# Altium schematic sheet 2_INTERFACES_EXTERNAS.SchDoc
size Tabloid; SheetNumber: 2; SheetTotal: 3; SPICEModelCacheOXJGALYG: <root> / <DocumentId>OXJGALYG</DocumentId> / <CacheFrame Number="0"> / <Model Name="0603_885012206052_1uf" Kind="CKT"> / <Text>******* / .subckt 0603_885012206052_1uF 1 2 / Rser 1 3 0.00742821402486 / Lser 2 4 2.51142993E-10 / C1 3 4 0.000001 / Rpar 3 4 100000000 / .ends 0603_885012206052_1uF</Text> / </Model> / </CacheFrame> / </root>
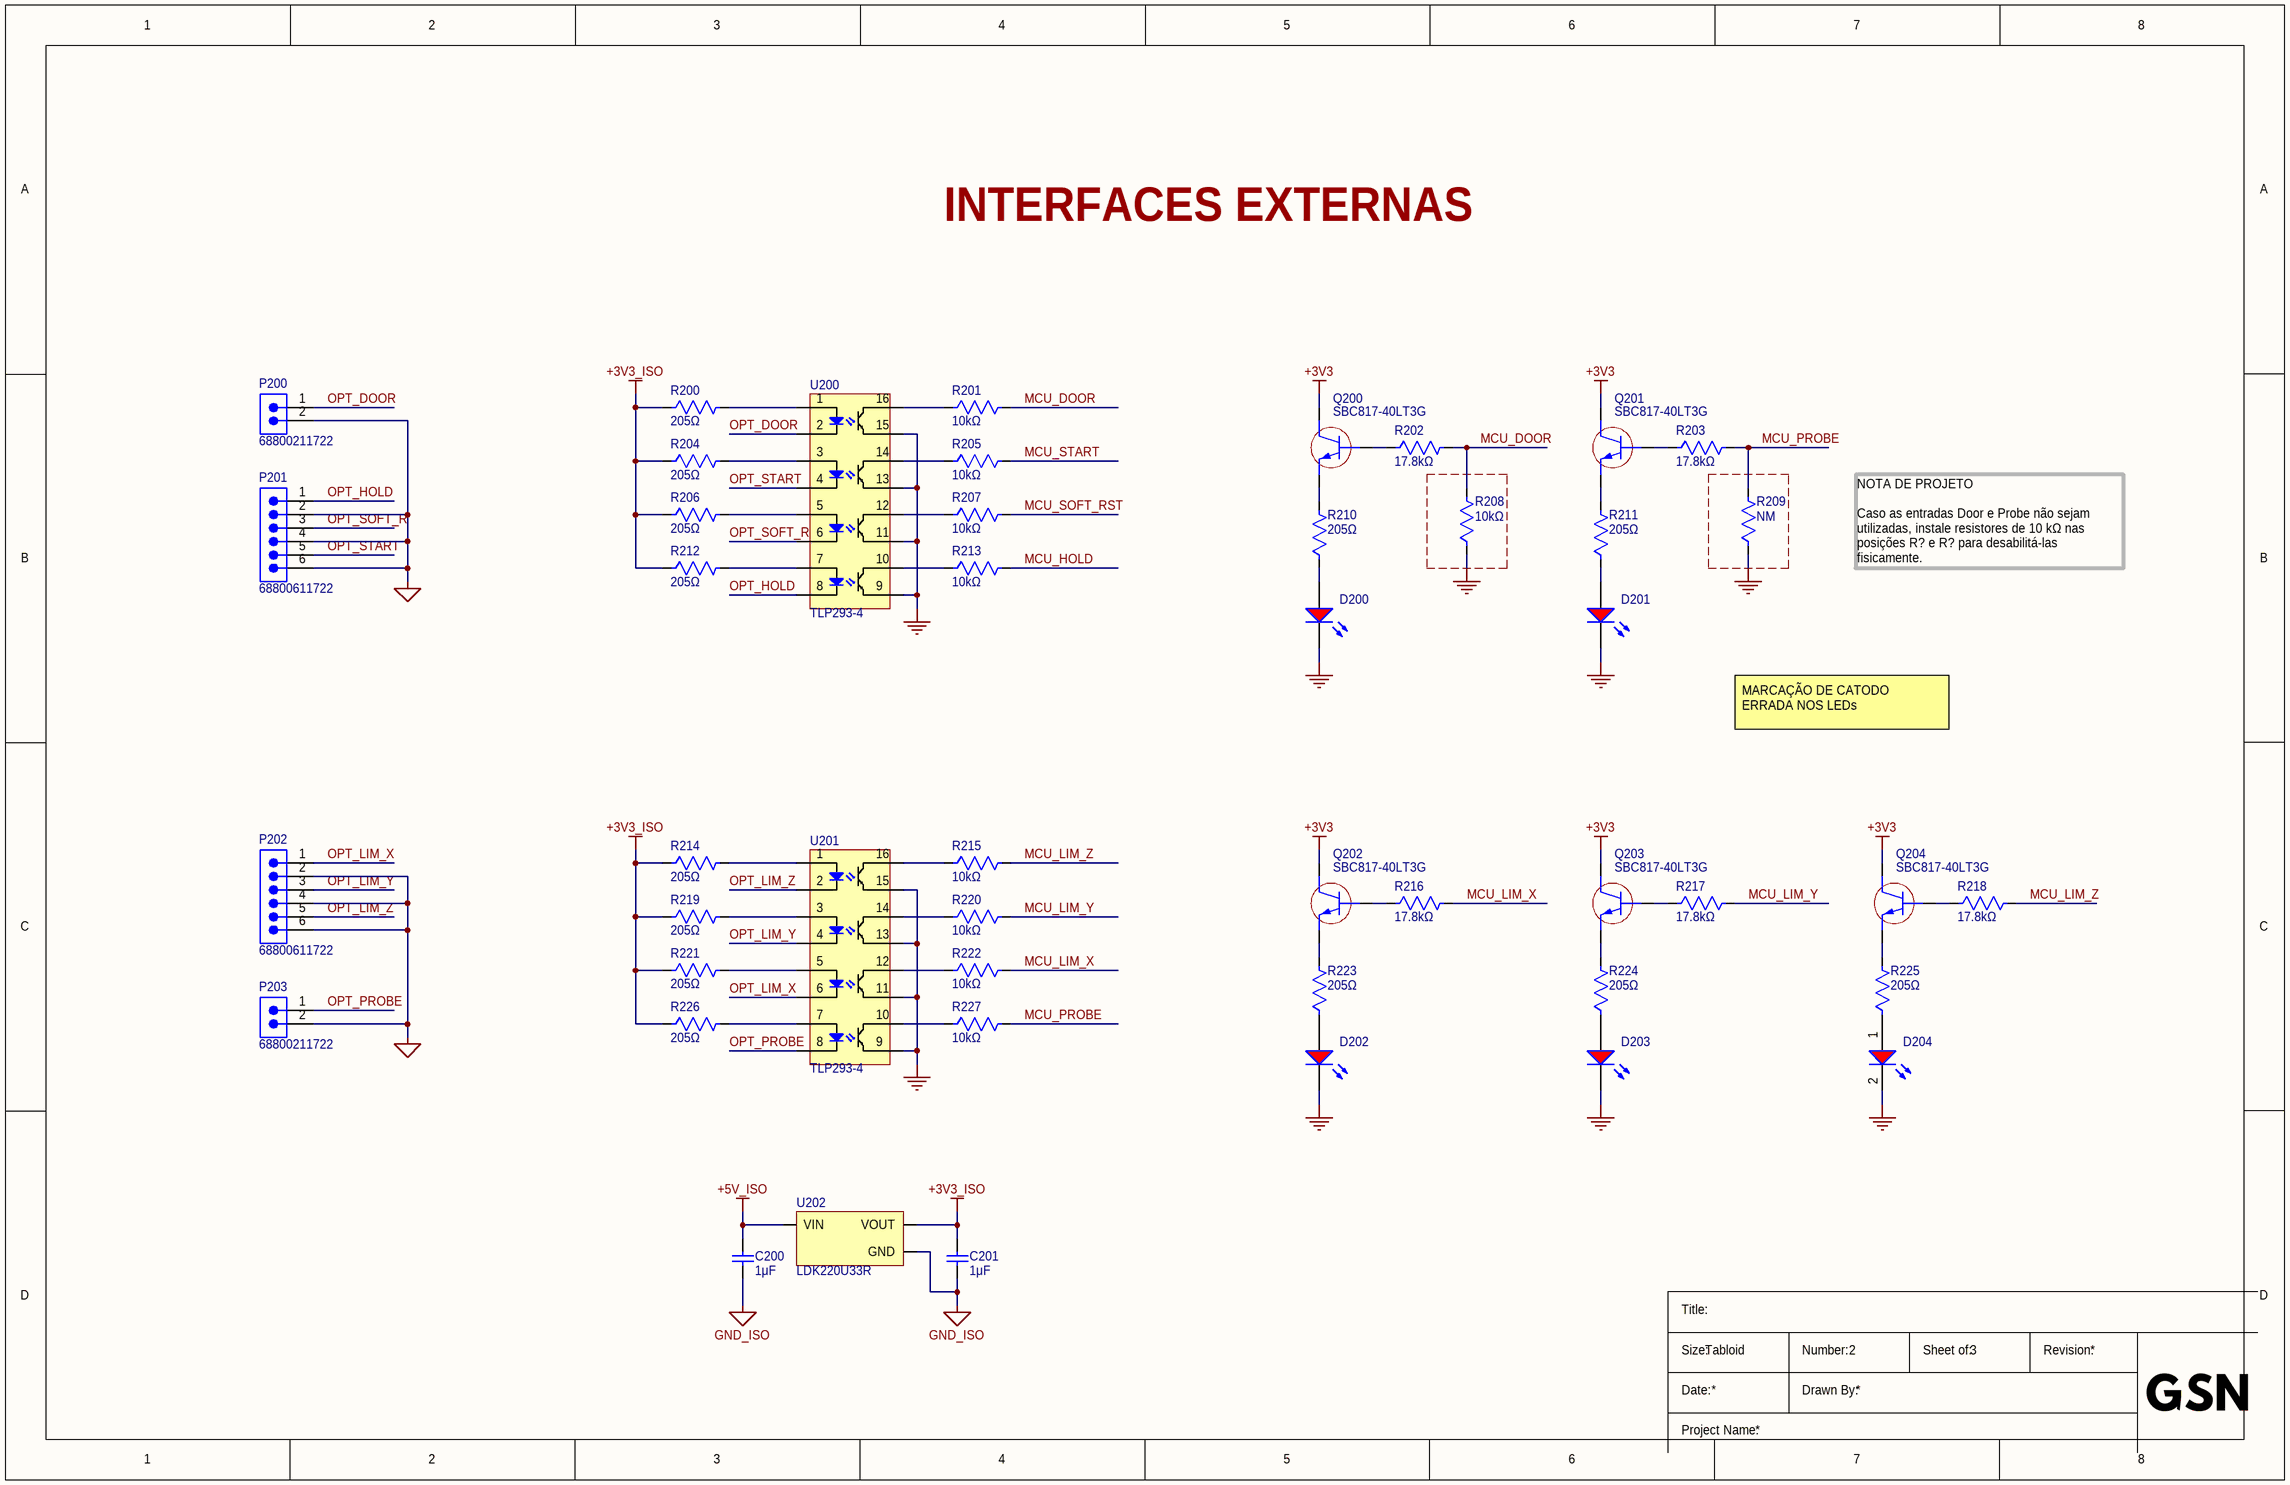
[diagram p0: 2_INTERFACES_EXTERNAS.SchDoc]

## Parts
C200  1μF  [WCAP-CSGP_0603_L1.6W0.8H0.8_Wave]
C201  1μF  [WCAP-CSGP_0603_L1.6W0.8H0.8_Wave]
D200  Red, 2V, 140deg  [WL-SMCW_0603_150060xx75003]  (value not drawn)
D201  Red, 2V, 140deg  [WL-SMCW_0603_150060xx75003]  (value not drawn)
D202  Red, 2V, 140deg  [WL-SMCW_0603_150060xx75003]  (value not drawn)
D203  Red, 2V, 140deg  [WL-SMCW_0603_150060xx75003]  (value not drawn)
D204  Red, 2V, 140deg  [WL-SMCW_0603_150060xx75003]  (value not drawn)
P200  68800211722  [68800211722]
P201  68800611722  [68800611722]
P202  68800611722  [68800611722]
P203  68800211722  [68800211722]
Q200  SBC817-40LT3G  [SOT-23-3]
Q201  SBC817-40LT3G  [SOT-23-3]
Q202  SBC817-40LT3G  [SOT-23-3]
Q203  SBC817-40LT3G  [SOT-23-3]
Q204  SBC817-40LT3G  [SOT-23-3]
R200  205Ω  [0603-WAVE]
R201  10kΩ  [0603-WAVE]
R202  17.8kΩ  [0603-WAVE]
R203  17.8kΩ  [0603-WAVE]
R204  205Ω  [0603-WAVE]
R205  10kΩ  [0603-WAVE]
R206  205Ω  [0603-WAVE]
R207  10kΩ  [0603-WAVE]
R208  10kΩ  [0603-WAVE]
R209  NM  [0603-WAVE]
R210  205Ω  [0603-WAVE]
R211  205Ω  [0603-WAVE]
R212  205Ω  [0603-WAVE]
R213  10kΩ  [0603-WAVE]
R214  205Ω  [0603-WAVE]
R215  10kΩ  [0603-WAVE]
R216  17.8kΩ  [0603-WAVE]
R217  17.8kΩ  [0603-WAVE]
R218  17.8kΩ  [0603-WAVE]
R219  205Ω  [0603-WAVE]
R220  10kΩ  [0603-WAVE]
R221  205Ω  [0603-WAVE]
R222  10kΩ  [0603-WAVE]
R223  205Ω  [0603-WAVE]
R224  205Ω  [0603-WAVE]
R225  205Ω  [0603-WAVE]
R226  205Ω  [0603-WAVE]
R227  10kΩ  [0603-WAVE]
U200  TLP293-4  [SO-16]
U201  TLP293-4  [SO-16]
U202  LDK220U33R  [SOT-89]

## Nets
+3V3: Q200.3(C) Q201.3(C) Q202.3(C) Q203.3(C) Q204.3(C)
+3V3_ISO: C201.2 R200.1 R204.1 R206.1 R212.1 R214.1 R219.1 R221.1 R226.1 U202.1(VOUT)
+5V_ISO: C200.2 U202.3(VIN)
GND: D200.2(K) D201.2(K) D202.2(K) D203.2(K) D204.2(K) R208.1 R209.1 U200.9 U200.11 U200.13 U200.15 U201.9 U201.11 U201.13 U201.15
GND_ISO: C200.1 C201.1 P200.2 P201.2 P201.4 P201.6 P202.2 P202.4 P202.6 P203.2 U202.2(GND)
MCU_DOOR: R201.2 R202.2 R208.2
MCU_HOLD: R213.2
MCU_LIM_X: R216.2 R222.2
MCU_LIM_Y: R217.2 R220.2
MCU_LIM_Z: R215.2 R218.2
MCU_PROBE: R203.2 R209.2 R227.2
MCU_SOFT_RST: R207.2
MCU_START: R205.2
OPT_DOOR: P200.1 U200.2
OPT_HOLD: P201.1 U200.8
OPT_LIM_X: P202.1 U201.6
OPT_LIM_Y: P202.3 U201.4
OPT_LIM_Z: P202.5 U201.2
OPT_PROBE: P203.1 U201.8
OPT_SOFT_R: P201.3 U200.6
OPT_START: P201.5 U200.4
NetD200_1: D200.1(A) R210.1
NetD201_1: D201.1(A) R211.1
NetD202_1: D202.1(A) R223.1
NetD203_1: D203.1(A) R224.1
NetD204_1: D204.1(A) R225.1
NetQ200_1: Q200.1(B) R202.1
NetQ200_2: Q200.2(E) R210.2
NetQ201_1: Q201.1(B) R203.1
NetQ201_2: Q201.2(E) R211.2
NetQ202_1: Q202.1(B) R216.1
NetQ202_2: Q202.2(E) R223.2
NetQ203_1: Q203.1(B) R217.1
NetQ203_2: Q203.2(E) R224.2
NetQ204_1: Q204.1(B) R218.1
NetQ204_2: Q204.2(E) R225.2
NetR200_2: R200.2 U200.1
NetR201_1: R201.1 U200.16
NetR204_2: R204.2 U200.3
NetR205_1: R205.1 U200.14
NetR206_2: R206.2 U200.5
NetR207_1: R207.1 U200.12
NetR212_2: R212.2 U200.7
NetR213_1: R213.1 U200.10
NetR214_2: R214.2 U201.1
NetR215_1: R215.1 U201.16
NetR219_2: R219.2 U201.3
NetR220_1: R220.1 U201.14
NetR221_2: R221.2 U201.5
NetR222_1: R222.1 U201.12
NetR226_2: R226.2 U201.7
NetR227_1: R227.1 U201.10

## Notes on the sheet
- INTERFACES EXTERNAS
- NOTA DE PROJETO
  Caso as entradas Door e Probe não sejam utilizadas, instale resistores de 10 kΩ nas posições R? e R? para desabilitá-las fisicamente.
- MARCAÇÃO DE CATODO ERRADA NOS LEDs
- Title:
- Size:
- Tabloid
- Number:
- Sheet of:
- Revision:
- Date:
- Project Name:
- Drawn By:

## Library data of the parts
C200 C201 = 885012206052: WCAP-CSGP Multilayer Ceramic Chip Capacitor, General Purpose, size 0603, 1μF, 16V; Manufacturer: Wurth Elektronik; Case/Size Code: 0603; Capacitance: 1uF; Capacitance Tolerance: +/-10%; Ceramic Type: X7R; Dissipation Factor: 10%; Insulation Resistance: 0.1Gohm; Technical Reference: X7R0603105K016DFCT10000; Manufacturer Part Number: 885012206052; Category: Multilayer Ceramic Chip Capacitors; Match Code: WCAP-CSGP; ComponentLink1Description: Website Link; ComponentLink1URL: https://www.we-online.com/redexpert/article/885012206052?ad; ComponentLink2Description: Datasheet Link; ComponentLink2URL: https://www.we-online.com/redexpert/spec/885012206052?ad; Mount: Surface Mount; Operating Temperature Min: -55degC; Operating Temperature Max: 125degC; Packaging: Tape and Reel; Length: 1.6mm; Width: 0.8mm; Height: 0.8mm; Rated Voltage (DC): 16V
D200-D204 = 150060RS75003: WL-SMCW Mono-color Chip LED Waterclear, SMT, size 0603, Red, 2V, 140°; Manufacturer: Wurth Elektronik; Case/Size Code: 0603; Chip Technology: AlInGaP; Dominant Wavelength: 625nm; Luminous Intensity: 530mcd; Peak Wavelength: 630nm; Manufacturer Part Number: 150060RS75003; Category: Signal LEDs; Match Code: WL-SMCW; ComponentLink1Description: Website Link; ComponentLink1URL: https://www.we-online.com/redexpert/article/150060RS75003?ad; ComponentLink2Description: Datasheet Link; ComponentLink2URL: https://www.we-online.com/redexpert/spec/150060RS75003?ad; Mount: Surface Mount; Packaging: Tape and Reel; Length: 1.6mm; Width: 0.8mm; Height: 0.7mm; Emitting Color: Red; Forward Voltage: 2V; Viewing Angle: 140deg; Operating Temperature Min: -40degC; Operating Temperature Max: 100degC
P200 P203 = 68800211722: WR-WTB “J” Type THT Male Horizontal Shrouded Header, pitch 2.5 mm, 2 pins; Manufacturer: Wurth Elektronik; Contact Resistance: 20 mohm; Rated Current: 3 A; Working Voltage: 250 V(AC); Withstanding Voltage: 800 V(AC); Manufacturer Part Number: 68800211722; Category: Wire-to-Board Connector; Match Code: WR-WTB; ComponentLink1Description: Website Link; ComponentLink1URL: https://www.we-online.com/redexpert/article/68800211722?ad; ComponentLink2Description: Datasheet Link; ComponentLink2URL: https://www.we-online.com/redexpert/spec/68800211722?ad; Mount: Through Hole; Operating Temperature Min: -25degC; Operating Temperature Max: 85degC; Packaging: Bag; Length: 7.5 mm; Width: 8.3 mm; Height: 4.2 mm; Gender: Male; Number of Pins: 2; Number of Rows: 1; Orientation: Horizontal; Lead Pitch: 2.5 mm
P201 P202 = 68800611722: WR-WTB “J” Type THT Male Horizontal Shrouded Header, pitch 2.5 mm, 6 pins; Manufacturer: Wurth Elektronik; Contact Resistance: 20 mohm; Rated Current: 3 A; Working Voltage: 250 V(AC); Withstanding Voltage: 800 V(AC); Manufacturer Part Number: 68800611722; Category: Wire-to-Board Connector; Match Code: WR-WTB; ComponentLink1Description: Website Link; ComponentLink1URL: https://www.we-online.com/redexpert/article/68800611722?ad; ComponentLink2Description: Datasheet Link; ComponentLink2URL: https://www.we-online.com/redexpert/spec/68800611722?ad; Mount: Through Hole; Operating Temperature Min: -25degC; Operating Temperature Max: 85degC; Packaging: Bag; Length: 17.5 mm; Width: 8.3 mm; Height: 4.2 mm; Gender: Male; Number of Pins: 6; Number of Rows: 1; Orientation: Horizontal; Lead Pitch: 2.5 mm
Q200-Q204 = SBC817-40LT3G: TRANS NPN 45V 0.5A SOT23-3; Manufacturer: onsemi; Manufacturer Lifecycle Status: ACTIVE; Collector Base Voltage (VCBO): 50V; Continuous Collector Current: 500mA; Element Configuration: Single; Emitter Base Voltage (VEBO): 5V; Frequency: 100MHz; hFE Min: 250; Max Power Dissipation: 300mW; Number of Elements: 1; Supplier: DigiKey; Supplier Part Number: SBC817-40LT3GOSCT-ND; Manufacturer Part Number: SBC817-40LT3G; RoHS: Compliant; Category: BJTs; Stock: 144045; Pricing: 1=0.24, 10=0.146, 100=0.0904, 500=0.06616, 1000=0.05829, 2000=0.05165, 5000=0.04443 (USD); Case/Package: SOT-23-3; China RoHS: Compliant; Collector Emitter Breakdown Voltage: 45V; Collector Emitter Voltage (VCEO): 45V; Country of Origin: Mainland China; Export Control Classification Number (ECCN) Code: EAR99; Halogen Free: Halogen Free; Introduction Date: 1991-03-01; Lead Free: Lead Free; Lifecycle Status: Production; Max Breakdown Voltage: 45V; Max Collector Current: 500mA; Clock Frequency: 100MHz; Max Operating Temperature: 150°C; Min Operating Temperature: -55°C; Pins: 3; Number of Terminals: 3; Packaging: Tape and Reel; Polarity: NPN; Power Dissipation: 300mW; Radiation Hardening: No; REACH SVHC: Yes; Schedule B: 8541210080, 8541210080|8541210080, 8541210080|8541210080|8541210080, 8541210080|8541210080|8541210080|8541210080; Transition Frequency: 100MHz; ComponentLink1URL: https://datasheet.octopart.com:443/SBC817-40LT3G-onsemi-datasheet-175914671.pdf?src-supplier=IHS; ComponentLink1Description: https://datasheet.octopart.com:443/SBC817-40LT3G-onsemi-datasheet-175914671.pdf?src-supplier=IHS; ComponentLink2URL: https://datasheet.octopart.com:443/SBC817-40LT3G-ON-Semiconductor-datasheet-11547464.pdf?src-supplier=Upverter; ComponentLink2Description: https://datasheet.octopart.com:443/SBC817-40LT3G-ON-Semiconductor-datasheet-11547464.pdf?src-supplier=Upverter; ComponentLink3URL: https://datasheet.octopart.com:443/SBC817-40LT3G-ON-Semiconductor-datasheet-78758879.pdf?src-supplier=Master+Electronics; ComponentLink3Description: https://datasheet.octopart.com:443/SBC817-40LT3G-ON-Semiconductor-datasheet-78758879.pdf?src-supplier=Master+Electronics; ComponentLink4URL: https://datasheet.octopart.com:443/SBC817-40LT3G-onsemi-datasheet-189132499.pdf?src-supplier=Master+Electronics; ComponentLink4Description: https://datasheet.octopart.com:443/SBC817-40LT3G-onsemi-datasheet-189132499.pdf?src-supplier=Master+Electronics; ComponentLink5URL: https://datasheet.octopart.com:443/SBC817-40LT3G-ON-Semiconductor-datasheet-8110464.pdf?src-supplier=onsemi; ComponentLink5Description: https://datasheet.octopart.com:443/SBC817-40LT3G-ON-Semiconductor-datasheet-8110464.pdf?src-supplier=onsemi; ComponentLink6URL: https://datasheet.octopart.com:443/SBC817-40LT3G-ON-Semiconductor-datasheet-6400296.pdf?src-supplier=onsemi; ComponentLink6Description: https://datasheet.octopart.com:443/SBC817-40LT3G-ON-Semiconductor-datasheet-6400296.pdf?src-supplier=onsemi; ComponentLink7URL: https://datasheet.octopart.com:443/SBC817-40LT3G-onsemi-datasheet-133521192.pdf?src-supplier=TME; ComponentLink7Description: https://datasheet.octopart.com:443/SBC817-40LT3G-onsemi-datasheet-133521192.pdf?src-supplier=TME; ComponentLink8URL: http://sigma.octopart.com:80/15540786/rohs_certificate/ON-Semiconductor-SBC817-40LT3G.pdf?src-supplier=Compliance+Statements; ComponentLink8Description: http://sigma.octopart.com:80/15540786/rohs_certificate/ON-Semiconductor-SBC817-40LT3G.pdf?src-supplier=Compliance+Statements; ComponentLink9URL: http://sigma.octopart.com:80/15684525/materials_sheet/ON-Semiconductor-SBC817-40LT3G.csv?src-supplier=Compliance+Statements; ComponentLink9Description: http://sigma.octopart.com:80/15684525/materials_sheet/ON-Semiconductor-SBC817-40LT3G.csv?src-supplier=Compliance+Statements; ComponentLink10URL: http://sigma.octopart.com:80/150631289/rohs_statement/ON-Semiconductor-SBC817-40LT3G.pdf?src-supplier=Compliance+Statements; ComponentLink10Description: http://sigma.octopart.com:80/150631289/rohs_statement/ON-Semiconductor-SBC817-40LT3G.pdf?src-supplier=Compliance+Statements; ComponentLink11URL: http://sigma.octopart.com:80/reach_statement/ON-Semiconductor-company-79.pdf?src-supplier=Compliance+Statements; ComponentLink11Description: http://sigma.octopart.com:80/reach_statement/ON-Semiconductor-company-79.pdf?src-supplier=Compliance+Statements; ComponentLink12URL: https://octopart.com:443/opatz8j6/c1?t=cEC30QwZsyb0x-FMX1jhecc8cj0lODbyQVaJL5I4EOudI-i4uiyo8QJe7x8WGpb_UfldyhXdI6wTsOpeJ5HWz7Kzleo1EiYpUhSwBawIenFlUCJsMQESd9nlIcVrbvWrabnb6HpXCtvxDkswRDKZDOG3MBWymJDy-mDPZ7u5UlptsX8-ONvWANeBowi-w7nz9iZWLyjqVoM_QTKEQgTILpDidA8CXVyMync_ukwLaadxciX7hbgDafM4N20bPQPEg7z2Sm1KwG15cEibpJqtQ1hKuQpn-edZc_o2ddvdnsTvT3gddPA_45tVxaNa9XWOJj00WFdTbgFSlU6TTFEybWVRRlK52823bHwN5uVZ-7M&src-supplier=Compliance+Statements; ComponentLink12Description: https://octopart.com:443/opatz8j6/c1?t=cEC30QwZsyb0x-FMX1jhecc8cj0lODbyQVaJL5I4EOudI-i4uiyo8QJe7x8WGpb_UfldyhXdI6wTsOpeJ5HWz7Kzleo1EiYpUhSwBawIenFlUCJsMQESd9nlIcVrbvWrabnb6HpXCtvxDkswRDKZDOG3MBWymJDy-mDPZ7u5UlptsX8-ONvWANeBowi-w7nz9iZWLyjqVoM_QTKEQgTILpDidA8CXVyMync_ukwLaadxciX7hbgDafM4N20bPQPEg7z2Sm1KwG15cEibpJqtQ1hKuQpn-edZc_o2ddvdnsTvT3gddPA_45tVxaNa9XWOJj00WFdTbgFSlU6TTFEybWVRRlK52823bHwN5uVZ-7M&src-supplier=Compliance+Statements; ComponentLink13URL: https://octopart.com:443/opatz8j6/c1?t=zgMoQUE-FAGizIL2uNADbP3CQfJXduVKNLOt0cT-C7XNOnl5EOgq1b4UVzb0SZjomH3a3CKF513mPEsnVuWFTldNModuoiOAROM-U7UMjU1TiA4JeYDoVNfia-psQDQPr2NtqLaOU9Ju06PrsXVFYjz3NjgsSVJa-5X9CcWQ1HPxPGGUjhKccWy9QJVPTcefUdorkFOZvdb3XFmpP_42jgzyR9ZUQAURqjwANTg96Z5ittV_NTML0IEyFPhh0jLh0am3ICJpb8VA9ph6AsqLc9j4fhdilqUiQTpG4UGLijUcgX0mpfEUR-9G0JRIiKjoFhJPWB3BEKd5JcwsK41biiNJ-0hjTcgtgsqlWYFFTPLS&src-supplier=Compliance+Statements; ComponentLink13Description: https://octopart.com:443/opatz8j6/c1?t=zgMoQUE-FAGizIL2uNADbP3CQfJXduVKNLOt0cT-C7XNOnl5EOgq1b4UVzb0SZjomH3a3CKF513mPEsnVuWFTldNModuoiOAROM-U7UMjU1TiA4JeYDoVNfia-psQDQPr2NtqLaOU9Ju06PrsXVFYjz3NjgsSVJa-5X9CcWQ1HPxPGGUjhKccWy9QJVPTcefUdorkFOZvdb3XFmpP_42jgzyR9ZUQAURqjwANTg96Z5ittV_NTML0IEyFPhh0jLh0am3ICJpb8VA9ph6AsqLc9j4fhdilqUiQTpG4UGLijUcgX0mpfEUR-9G0JRIiKjoFhJPWB3BEKd5JcwsK41biiNJ-0hjTcgtgsqlWYFFTPLS&src-supplier=Compliance+Statements
R200 R204 R206 R210-R212 R214 R219 R221 R223-R226 = RC0603FR-07205RL: RES 205 OHM 1% 1/10W 0603; Manufacturer: Yageo Group; Max Power Dissipation: 100mW; Temperature Coefficient: ±200ppm/°C; Voltage Rating (AC): 50V; Voltage Rating: 75V; Supplier Part Number: 311-205HRCT-ND; Manufacturer Part Number: RC0603FR-07205RL; Value: 205Ω; Case Code (Imperial): 0603; Case Code (Metric): 1608; Case/Package: 0603; Category: Chip SMD Resistors; China RoHS: Non-Compliant; Composition: Thick Film; Contact Plating: Tin; Depth: 800µm; Features: Moisture Resistant; Height: 450µm; Lead Free: Lead Free; Length: 1.6mm; Lifecycle Status: Production; Max Operating Temperature: 155°C; Military Standard: Not; Min Operating Temperature: -55°C; Mounting Technology: Surface Mount; Number of Terminals: 2; Number of Terminations: 2; Packaging: Tape & Reel; Power Dissipation: 100mW; Power Rating: 100mW; Radiation Hardening: No; REACH SVHC: Yes; RoHS: Compliant; Supplier: DigiKey; Termination: SMD/SMT; Tolerance: 1%; Component Link Description: https://www.yageogroup.com/content/datasheet/asset/file/PYU-RC_GROUP_51_ROHS_L; Component Link URL: https://www.yageogroup.com/content/datasheet/asset/file/PYU-RC_GROUP_51_ROHS_L; Datasheet: https://www.yageogroup.com/content/datasheet/asset/file/PYU-RC_GROUP_51_ROHS_L; Voltage Rating (DC): 50V; Weight: 2.012816mg; Width: 800µm; Working Voltage: 75V
R201 R205 R207-R209 R213 R215 R220 R222 R227 = RC0603FR-0710KL: RES 10K OHM 1% 1/10W 0603; Manufacturer: Yageo Group; Max Power Dissipation: 100mW; Temperature Coefficient: ±200ppm/°C; Voltage Rating (AC): 50V; Voltage Rating: 75V; Supplier Part Number: 311-10.0KHRCT-ND; Manufacturer Part Number: RC0603FR-0710KL; Case Code (Imperial): 0603; Case Code (Metric): 1608; Case/Package: 0603; Category: Chip SMD Resistors; China RoHS: Non-Compliant; Composition: Thick Film; Contact Plating: Tin; Depth: 800µm; Features: Moisture Resistant; Height: 450µm; Lead Free: Lead Free; Length: 1.6mm; Lifecycle Status: Production; Max Operating Temperature: 155°C; Military Standard: Not; Min Operating Temperature: -55°C; Mounting Technology: Surface Mount; Number of Terminals: 2; Number of Terminations: 2; Packaging: Tape & Reel; Power Dissipation: 100mW; Power Rating: 100mW; Radiation Hardening: No; REACH SVHC: Yes; RoHS: Compliant; Supplier: DigiKey; Termination: SMD/SMT; Tolerance: 1%; Component Link Description: https://www.yageogroup.com/content/datasheet/asset/file/PYU-RC_GROUP_51_ROHS_L; Component Link URL: https://www.yageogroup.com/content/datasheet/asset/file/PYU-RC_GROUP_51_ROHS_L; Datasheet: https://www.yageogroup.com/content/datasheet/asset/file/PYU-RC_GROUP_51_ROHS_L; Voltage Rating (DC): 50V; Weight: 2.012816mg; Width: 800µm; Working Voltage: 75V
  R201 R205 R207 R208 R213 R215 R220 R222 R227: Value: 10kΩ
  R209: Value: NM
R202 R203 R216-R218 = RC0603FR-0717K8L: RES 17.8K OHM 1% 1/10W 0603; Manufacturer: Yageo Group; Max Power Dissipation: 100mW; Temperature Coefficient: ±200ppm/°C; Voltage Rating (AC): 50V; Voltage Rating: 75V; Supplier Part Number: 311-17.8KHRCT-ND; Manufacturer Part Number: RC0603FR-0717K8L; Value: 17.8kΩ; Case Code (Imperial): 0603; Case Code (Metric): 1608; Case/Package: 0603; Category: Chip SMD Resistors; China RoHS: Non-Compliant; Composition: Thick Film; Contact Plating: Tin; Depth: 800µm; Features: Moisture Resistant; Height: 450µm; Lead Free: Lead Free; Length: 1.6mm; Lifecycle Status: Production; Max Operating Temperature: 155°C; Military Standard: Not; Min Operating Temperature: -55°C; Mounting Technology: Surface Mount; Number of Terminals: 2; Number of Terminations: 2; Packaging: Tape & Reel; Power Dissipation: 100mW; Power Rating: 100mW; Radiation Hardening: No; REACH SVHC: Yes; RoHS: Compliant; Supplier: DigiKey; Termination: SMD/SMT; Tolerance: 1%; Component Link Description: https://www.yageogroup.com/content/datasheet/asset/file/PYU-RC_GROUP_51_ROHS_L; Component Link URL: https://www.yageogroup.com/content/datasheet/asset/file/PYU-RC_GROUP_51_ROHS_L; Datasheet: https://www.yageogroup.com/content/datasheet/asset/file/PYU-RC_GROUP_51_ROHS_L; Voltage Rating (DC): 50V; Weight: 2.012816mg; Width: 800µm; Working Voltage: 75V
U200 U201 = TLP293-4: OPTOISO 3.75KV 4CH TRANS 16-SO; Manufacturer: Toshiba; Manufacturer Part Number: TLP293-4(TP,E; Collector Emitter Breakdown Voltage: 80V; Collector Emitter Saturation Voltage: 300mV; Current Transfer Ratio: 50%; Dark Current: 80nA; Forward Current: 50mA; Forward Voltage: 1.4V; Max Junction Temperature (Tj): 125°C; Max Power Dissipation: 100mW; Number of Channels: 4; Turn-Off Delay Time: 3µs; Supplier: DigiKey; Supplier Part Number: TLP293-4(TPECT-ND; RoHS: Compliant; Category: Optocouplers; Stock: 42408; Pricing: 1=1.54, 10=1.093, 100=0.8233, 500=0.704, 1000=0.66505 (USD); Case/Package: SOIC; Collector Emitter Voltage (VCEO): 300mV; Height: 2.3mm; Isolation Voltage: 3.75kV; Lifecycle Status: Production; Max Operating Temperature: 125°C; Max Output Voltage: 80V; Min Operating Temperature: -55°C; Mounting Technology: Surface Mount; Number of Elements: 4; Pins: 16; Output Current per Channel: 50mA; Packaging: Tape & Reel (TR); REACH SVHC: Yes; Schedule B: 8541408000, 8541408000|8541408000|8541408000|8541408000|8541408000; Turn-On Delay Time: 3µs; ComponentLink1URL: https://datasheet.octopart.com:443/TLP293-4%28TP%2CE-Toshiba-datasheet-165584699.pdf?src-supplier=IHS; ComponentLink1Description: https://datasheet.octopart.com:443/TLP293-4%28TP%2CE-Toshiba-datasheet-165584699.pdf?src-supplier=IHS; ComponentLink2URL: https://datasheet.octopart.com:443/TLP293-4%28TP%2CE-Toshiba-datasheet-62096132.pdf?src-supplier=Upverter; ComponentLink2Description: https://datasheet.octopart.com:443/TLP293-4%28TP%2CE-Toshiba-datasheet-62096132.pdf?src-supplier=Upverter
U202 = LDK220U33R: IC REG LINEAR 3.3V 200MA SOT89; Manufacturer: STMicroelectronics; Max Supply Voltage: 13.2V; Max Junction Temperature (Tj): 125°C; Min Input Voltage: 4.3V; Number of Channels: 1; Output Type: Fixed; Voltage Tolerance: 3%; Supplier: DigiKey; Supplier Part Number: 497-17107-1-ND; Manufacturer Part Number: LDK220U33R; RoHS: Compliant; Category: LDO Voltage Regulators; Stock: 20368; Pricing: 1=0.39, 10=0.268, 25=0.2388, 100=0.2061, 250=0.1906, 500=0.18124, 1000=0.17353 (USD); China RoHS: Compliant; Height - Seated (Max): 1.6mm; Length: 4.5mm; Lifecycle Status: Production; Number of Circuits: 1; Number of Outputs: 1; Number of Terminals: 3; Output Current: 200mA; Output Voltage: 3.3V; Packaging: Cut Tape; REACH SVHC: Yes; Schedule B: 8542390000, 8542390000|8542390000|8542390000|8542390000|8542390000; Terminal Pitch: 1.495mm; Width: 2.445mm; ComponentLink1URL: https://datasheet.octopart.com:443/LDK220U33R-STMicroelectronics-datasheet-164563982.pdf?src-supplier=IHS; ComponentLink1Description: https://datasheet.octopart.com:443/LDK220U33R-STMicroelectronics-datasheet-164563982.pdf?src-supplier=IHS; ComponentLink2URL: https://datasheet.octopart.com:443/LDK220U33R-STMicroelectronics-datasheet-78844600.pdf?src-supplier=HQonline; ComponentLink2Description: https://datasheet.octopart.com:443/LDK220U33R-STMicroelectronics-datasheet-78844600.pdf?src-supplier=HQonline; ComponentLink3URL: https://datasheet.octopart.com:443/LDK220U33R-STMicroelectronics-datasheet-101746762.pdf?src-supplier=SHENGYU+ELECTRONICS; ComponentLink3Description: https://datasheet.octopart.com:443/LDK220U33R-STMicroelectronics-datasheet-101746762.pdf?src-supplier=SHENGYU+ELECTRONICS